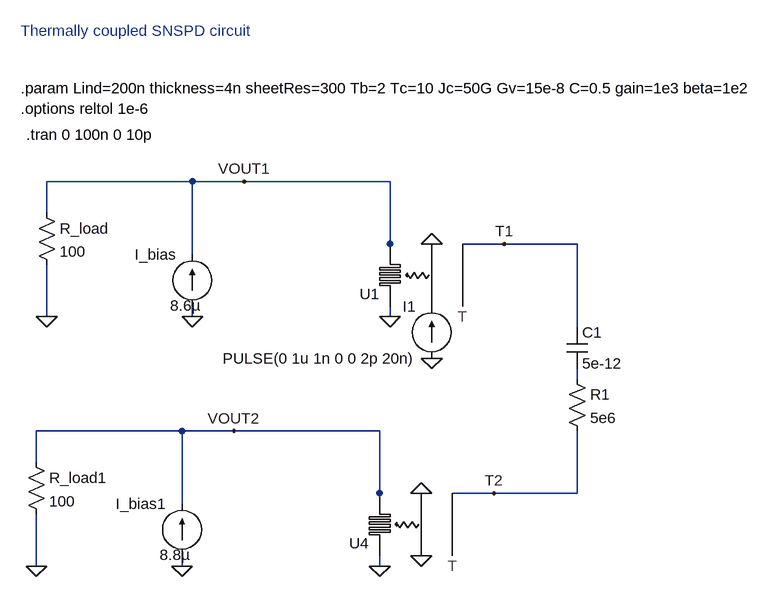
[diagram p0: schematic snspd-thermal-coupling.asc]
snspd-thermal-coupling.asc, the LTspice schematic file:
Version 4
SHEET 1 1656 680
WIRE -752 -800 -976 -800
WIRE -672 -800 -752 -800
WIRE -448 -800 -672 -800
WIRE -976 -752 -976 -800
WIRE -448 -704 -448 -800
WIRE -272 -704 -336 -704
WIRE -160 -704 -272 -704
WIRE -752 -688 -752 -800
WIRE -448 -688 -448 -704
WIRE -976 -592 -976 -672
WIRE -752 -592 -752 -608
WIRE -448 -592 -448 -608
WIRE -160 -576 -160 -704
WIRE -160 -496 -160 -512
WIRE -768 -416 -992 -416
WIRE -688 -416 -768 -416
WIRE -464 -416 -688 -416
WIRE -992 -368 -992 -416
WIRE -464 -320 -464 -416
WIRE -288 -320 -352 -320
WIRE -160 -320 -160 -416
WIRE -160 -320 -288 -320
WIRE -768 -304 -768 -416
WIRE -464 -304 -464 -320
WIRE -992 -208 -992 -288
WIRE -768 -208 -768 -224
WIRE -464 -208 -464 -224
FLAG -672 -800 VOUT1
FLAG -384 -528 0
FLAG -384 -704 0
FLAG -976 -592 0
FLAG -448 -592 0
FLAG -752 -592 0
FLAG -272 -704 T1
FLAG -688 -416 VOUT2
FLAG -400 -320 0
FLAG -992 -208 0
FLAG -464 -208 0
FLAG -768 -208 0
FLAG -400 -224 0
FLAG -288 -320 T2
SYMBOL res -992 -768 R0
SYMATTR InstName R_load
SYMATTR Value 100
SYMBOL current -752 -608 R180
WINDOW 0 24 80 Left 2
WINDOW 3 -13 1 Left 2
WINDOW 123 0 0 Left 0
WINDOW 39 0 0 Left 0
SYMATTR InstName I_bias
SYMATTR Value 8.6µ
SYMBOL snspd_thermal_port -448 -656 R180
WINDOW 39 16 -57 Invisible 2
SYMATTR SpiceLine Lind={Lind} thickness={thickness} sheetRes={sheetRes} Tb={Tb} Tc={Tc}  Jc={Jc} Gv={Gv} C={C} gain= {gain} beta = {beta}
SYMATTR InstName U1
SYMBOL res -1008 -384 R0
SYMATTR InstName R_load1
SYMATTR Value 100
SYMBOL current -768 -224 R180
WINDOW 0 24 80 Left 2
WINDOW 3 -13 1 Left 2
WINDOW 123 0 0 Left 0
WINDOW 39 0 0 Left 0
SYMATTR InstName I_bias1
SYMATTR Value 8.8µ
SYMBOL snspd_thermal_port -464 -272 R180
WINDOW 39 29 327 Invisible 2
SYMATTR SpiceLine Lind={Lind} thickness={thickness} sheetRes={sheetRes} Tb={Tb} Tc={Tc}  Jc={Jc} Gv={Gv} C={C} gain= {gain} beta = {beta}
SYMATTR InstName U4
SYMBOL res -176 -512 R0
SYMATTR InstName R1
SYMATTR Value 5e6
SYMBOL cap -176 -576 R0
SYMATTR InstName C1
SYMATTR Value 5e-12
SYMBOL current -384 -528 R180
WINDOW 0 24 80 Left 2
WINDOW 3 24 0 Left 2
WINDOW 123 0 0 Left 0
WINDOW 39 0 0 Left 0
SYMATTR InstName I1
SYMATTR Value PULSE(0 1u 1n 0 0 2p 20n)
TEXT -1008 -872 Left 2 !.tran 0 100n 0 10p
TEXT -1016 -912 Left 2 !.options reltol 1e-6
TEXT -1016 -944 Left 2 !.param Lind=200n thickness=4n sheetRes=300 Tb=2 Tc=10 Jc=50G Gv=15e-8 C=0.5 gain=1e3 beta=1e2
TEXT -1016 -1032 Left 2 ;Thermally coupled SNSPD circuit

The netlist it stands for:
* snspd-thermal-coupling.asc
R_load VOUT1 0 100
I_bias 0 VOUT1 8.6µ
XU1 P001 0 0 VOUT1 T1 nanowire_thermal_port Lind={Lind} thickness={thickness} sheetRes={sheetRes} Tb={Tb} Tc={Tc}  Jc={Jc} Gv={Gv} C={C} gain= {gain} beta = {beta}  ; pins gate-in photon-out ? ? t_couple_in
R_load1 VOUT2 0 100
I_bias1 0 VOUT2 8.8µ
XU4 0 0 0 VOUT2 T2 nanowire_thermal_port Lind={Lind} thickness={thickness} sheetRes={sheetRes} Tb={Tb} Tc={Tc}  Jc={Jc} Gv={Gv} C={C} gain= {gain} beta = {beta}  ; pins gate-in photon-out ? ? t_couple_in
R1 N001 T2 5e6
C1 T1 N001 5e-12
I1 0 P001 PULSE(0 1u 1n 0 0 2p 20n)
.tran 0 100n 0 10p
.options reltol 1e-6
.param Lind=200n thickness=4n sheetRes=300 Tb=2 Tc=10 Jc=50G Gv=15e-8 C=0.5 gain=1e3 beta=1e2
* Thermally coupled SNSPD circuit
.lib snspd_thermal_port.lib
.backanno
.end